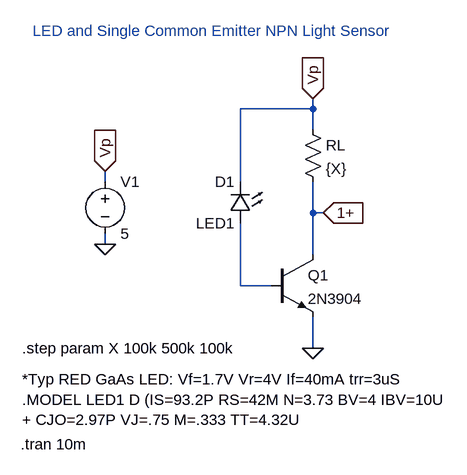
[diagram p0: schematic led_single_emitter_ltspice.asc]
led_single_emitter_ltspice.asc, the LTspice schematic file:
Version 4
SHEET 1 880 680
WIRE 304 16 304 0
WIRE 304 16 192 16
WIRE 304 48 304 16
WIRE -16 128 -16 112
WIRE 192 128 192 16
WIRE 304 176 304 128
WIRE 320 176 304 176
WIRE -16 224 -16 208
WIRE 304 240 304 176
WIRE 192 288 192 192
WIRE 240 288 192 288
WIRE 304 384 304 336
FLAG 304 0 Vp
IOPIN 304 0 In
FLAG 320 176 1+
IOPIN 320 176 In
FLAG 304 384 0
FLAG -16 224 0
FLAG -16 112 Vp
IOPIN -16 112 In
SYMBOL LED 208 192 R180
WINDOW 0 24 64 Left 2
WINDOW 3 24 0 Left 2
SYMATTR InstName D1
SYMATTR Value LED1
SYMBOL res 288 32 R0
SYMATTR InstName RL
SYMATTR Value {X}
SYMBOL npn 240 240 R0
SYMATTR InstName Q1
SYMATTR Value 2N3904
SYMBOL voltage -16 112 R0
WINDOW 123 0 0 Left 0
WINDOW 39 0 0 Left 0
SYMATTR InstName V1
SYMATTR Value 5
TEXT -128 -104 Left 2 ;LED and Single Common Emitter NPN Light Sensor
TEXT -144 432 Left 2 !*Typ RED GaAs LED: Vf=1.7V Vr=4V If=40mA trr=3uS\n.MODEL LED1 D (IS=93.2P RS=42M N=3.73 BV=4 IBV=10U\n+ CJO=2.97P VJ=.75 M=.333 TT=4.32U
TEXT -146 532 Left 2 !.tran 10m
TEXT -144 384 Left 2 !.step param X 100k 500k 100k

The netlist it stands for:
* led_single_emitter_ltspice.asc
D1 N001 Vp LED1
RL Vp 1+ {X}
Q1 1+ N001 0 0 2N3904
V1 Vp 0 5
.model D D
.lib standard.dio
.model NPN NPN
.model PNP PNP
.lib standard.bjt
* LED and Single Common Emitter NPN Light Sensor
*Typ RED GaAs LED: Vf=1.7V Vr=4V If=40mA trr=3uS
.MODEL LED1 D (IS=93.2P RS=42M N=3.73 BV=4 IBV=10U
+ CJO=2.97P VJ=.75 M=.333 TT=4.32U
.tran 10m
.step param X 100k 500k 100k
.backanno
.end